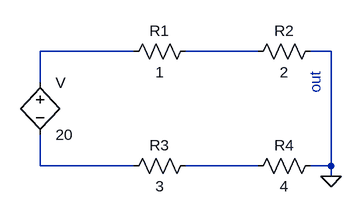
[diagram p0: schematic Primer1.asc]
Primer1.asc, the LTspice schematic file:
Version 4
SHEET 1 880 680
WIRE 48 64 -96 64
WIRE 240 64 128 64
WIRE 352 64 320 64
WIRE -96 112 -96 64
WIRE -96 240 -96 192
WIRE 48 240 -96 240
WIRE 240 240 128 240
WIRE 352 240 352 64
WIRE 352 240 320 240
WIRE 352 256 352 240
FLAG 352 256 0
SYMBOL res 144 48 R90
WINDOW 0 0 56 VBottom 2
WINDOW 3 32 56 VTop 2
SYMATTR InstName R1
SYMATTR Value 1
SYMBOL res 336 48 R90
WINDOW 0 0 56 VBottom 2
WINDOW 3 32 56 VTop 2
SYMATTR InstName R2
SYMATTR Value 2
SYMBOL res 144 224 R90
WINDOW 0 0 56 VBottom 2
WINDOW 3 32 56 VTop 2
SYMATTR InstName R3
SYMATTR Value 3
SYMBOL res 336 224 R90
WINDOW 0 0 56 VBottom 2
WINDOW 3 32 56 VTop 2
SYMATTR InstName R4
SYMATTR Value 4
SYMBOL bv -96 96 R0
SYMATTR InstName V
SYMATTR Value 20
SYMATTR Prefix ""
TEXT 328 128 VLeft 2 ;out

The netlist it stands for:
* Primer1.asc
R1 N002 N001 1
R2 0 N002 2
R3 N004 N003 3
R4 0 N004 4
XV N001 N003 20  ; pins + -
* out
.backanno
.end